# Altium schematic sheet v1.3.SchDoc
size 50 x 50 mm
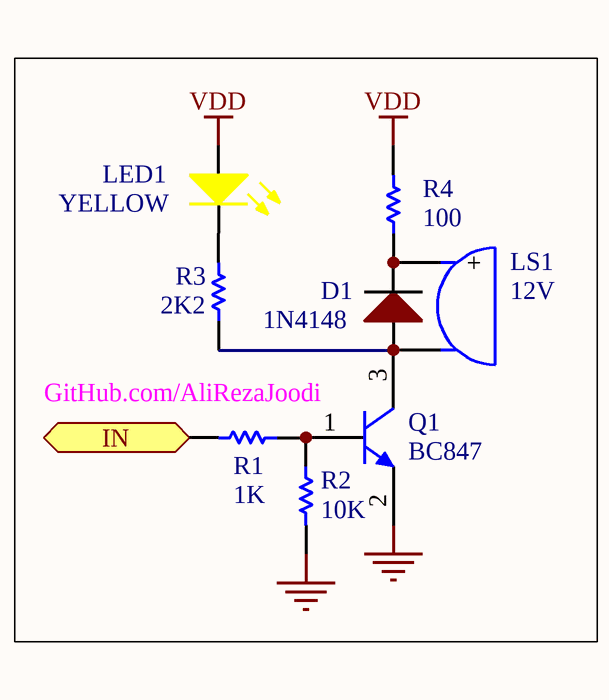
[diagram p0: v1.3.SchDoc]

## Parts
D1  1N4148  [D_THD_AXIAL0.3_DO-35]
LED1  YELLOW  [LED_THD_3MM_YELLOW_R]
LS1  12V  [RB_7.62mm]
Q1  value BC847  [SOT23-3N]  (hidden comment: NPN)
R1  value 1K  [0805]  (hidden comment: Res1)
R2  value 10K  [0805]  (hidden comment: Res1)
R3  2K2  [0805]
R4  value 100  [0805]  (hidden comment: Res1)

## Ports
IN (in)

## Nets
GND: Q1.2(E) R2.2
VDD: LED1.1(A) R4.2
IN: R1.2 ; port IN
NetD1_1: D1.1(A) LS1.2(B) Q1.3(C) R3.1
NetD1_2: D1.2(K) LS1.1(+) R4.1
NetLED1_2: LED1.2(K) R3.2
NetQ1_1: Q1.1(B) R1.1 R2.1

## Notes on the sheet
- GitHub.com/AliRezaJoodi

## Library data of the parts
D1 = Diode_2Form: Diode,; Revision: July-2002: Re-released for DXP Platform.
LED1 = LED_YELLOW: LED, Yellow; Manufacturer: Generic Components; Class I: Optoelectronic; Published: 8-Jun-2000; Revision: July-2002: Re-released for DXP Platform.; Publisher: Altium Limited; Class II: LED
LS1 = Buzzer: Sounder; Revision: July-2002: Re-released for DXP Platform.; Publisher: Altium Limited
Q1 = BC847: Silicon Bipolar Transistor
R1-R4 = Res1: Resistor; Published: 8-Jun-2000; LatestRevisionDate: 17-Jul-2002; LatestRevisionNote: Re-released for DXP Platform.; PackageReference: AXIAL-0.3; Publisher: Altium Limited